# Altium schematic sheet PSDT RAM v1.0.0.SchDoc: Probe-Scope Digital Test: RAM
size Letter; CompanyName: Probe-Scope; Organization: Probe-Scope; Address1: Probe-Scope: Unified USB; Address2: Oscilloscope Probe; Address3: ©2019 M. Omo, J. Rowley,; Address4: K. Hall, released under the; DocumentNumber: SCH0020; SheetNumber: 3; PageSetup: Record=PageOptions|CenterHorizontal=True|CenterVertical=True|PrintScale=0.96|XCorrection=1.00|YCorrection=1.00|PrintKind=1|BorderSize=5000000|LeftOffset=0|BottomOffset=0|Orientation=2|PaperLength=1000|PaperWidth=1000|Scale=100|PaperSource=7|PrintQuality=-4|MediaType=1|DitherType=10|PaperKind=11x17|PrintScaleMode=1; Assembly: ASP0020; License: CERN OHL v1.2
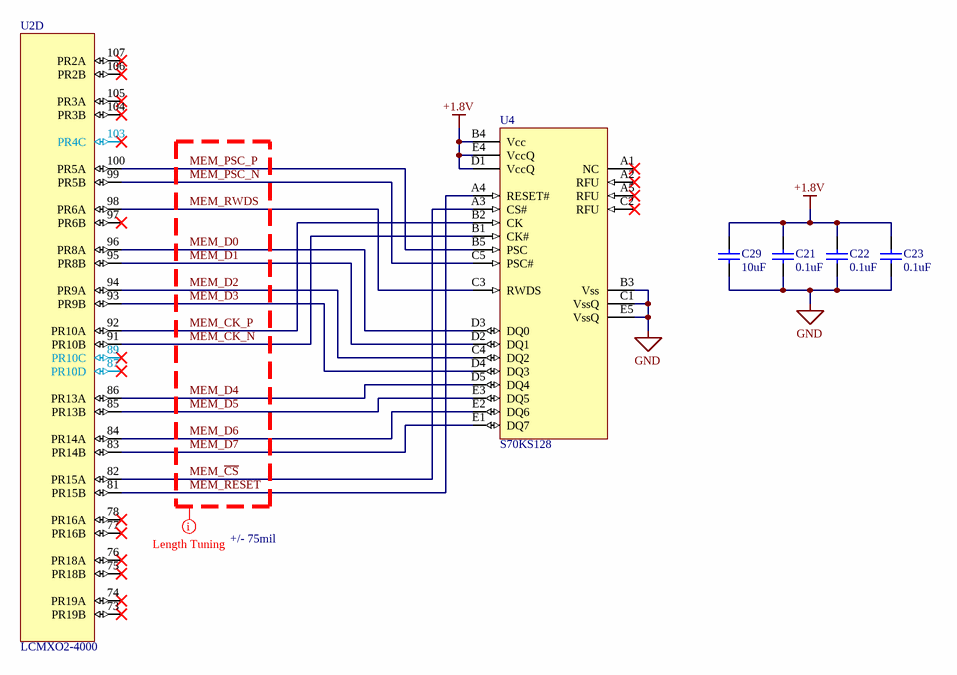
[diagram p0: PSDT RAM v1.0.0.SchDoc]

## Parts
C21  value 0.1uF  [0402(1005)]  (hidden comment: 6.3V)
C22  value 0.1uF  [0402(1005)]  (hidden comment: 6.3V)
C23  value 0.1uF  [0402(1005)]  (hidden comment: 6.3V)
C29  value 10uF  [0603(1608)]  (hidden comment: 25V)
U2  LCMXO2-4000  [UL_TQFP144]  (part D of 5)
U4  S70KS128  [Cypress-VAA024]

## Nets
+1.8V: C21.2 C22.2 C23.2 C29.2 U4.B4(Vcc) U4.D1(VccQ) U4.E4(VccQ)
GND: C21.1 C22.1 C23.1 C29.1 U4.B3(Vss) U4.C1(VssQ) U4.E5(VssQ)
MEM_~{CS}: U2.82(PR15A) U4.A3(CS#)
MEM_CK_N: U2.91(PR10B) U4.B1(CK#)
MEM_CK_P: U2.92(PR10A) U4.B2(CK)
MEM_D0: U2.96(PR8A) U4.D3(DQ0)
MEM_D1: U2.95(PR8B) U4.D2(DQ1)
MEM_D2: U2.94(PR9A) U4.C4(DQ2)
MEM_D3: U2.93(PR9B) U4.D4(DQ3)
MEM_D4: U2.86(PR13A) U4.D5(DQ4)
MEM_D5: U2.85(PR13B) U4.E3(DQ5)
MEM_D6: U2.84(PR14A) U4.E2(DQ6)
MEM_D7: U2.83(PR14B) U4.E1(DQ7)
MEM_PSC_N: U2.99(PR5B) U4.C5(PSC#)
MEM_PSC_P: U2.100(PR5A) U4.B5(PSC)
MEM_~{RESET}: U2.81(PR15B) U4.A4(RESET#)
MEM_RWDS: U2.98(PR6A) U4.C3(RWDS)

Not connected (* = marked no-connect by the designer): U2 73(PR19B)* 74(PR19A)* 75(PR18B)* 76(PR18A)* 77(PR16B)* 78(PR16A)* 87(PR10D)* 89(PR10C)* 97(PR6B)* 103(PR4C)* 104(PR3B)* 105(PR3A)* 106(PR2B)* 107(PR2A)*; U4 A1(NC)* A2(RFU)* A5(RFU)* C2(RFU)*

## Layout directives
net class MEMDDR - 150mil: MEM_CK_N, MEM_CK_P, MEM_D0, MEM_D1, MEM_D2, MEM_D3, MEM_D4, MEM_D5, MEM_D6, MEM_D7, MEM_PSC_N, MEM_PSC_P, MEM_RWDS, MEM_~{CS}, MEM_~{RESET}

## Notes on the sheet
- +/- 75mil
- Title:
- Asm:
- Date:
- Variant:
- Time:
- Number:
- Sheet
- of
- Rev:
- File:

## Library data of the parts
C21-C23 = 1875: Key: 1875; MENG_PN: ???1875; MANF: Samsung Electro-Mechanics; MANF_PN: CL05B104KQ5NNNC; VENDOR: Digikey; VENDOR_PN: 1276-1511-1-ND; P&V Description: Capacitor, Ceramic, 0.1uF, 6.3V, 10% Tol, 125C, X7R, 0402, SMD; Class: Capacitor; Type: Ceramic; Other: X7R; Tolerance: 10; Voltage: 6.3; Max Temperature: 125; Approved: False; Package: 0402; SMD: True; Date Modified: 11/6/2018 11:14:02 AM; Modified By: jrowley; Parent Key: 1875; Verified: False
C29 = 1306: Key: 1306; MENG_PN: ???1306; MANF: Samsung Electro-Mechanics; MANF_PN: CL10A106MA8NRNC; VENDOR: Digikey; VENDOR_PN: 1276-1869-1-ND; P&V Description: Capacitor, Ceramic, 10uF, 25V, 20% Tol, 85C, X5R, 0603, SMD; Class: Capacitor; Type: Ceramic; Other: X5R; Tolerance: 20; Voltage: 25; Max Temperature: 85; Approved: True; Package: 0603; SMD: True; Date Modified: 3/3/2015 11:08:29 AM; Modified By: sotterbacher; Parent Key: 1306; Verified: True
U2 = MachXO2-4000-TG144: MANF: Lattice Semiconductor Corporation; MANF_PN: LCMXO2-4000HC-4TG144C; VENDOR: DigiKey; VENDOR_PN: 220-1460-ND
U4 = S70KS: MANF: Cypress; MANF_PN: S70KS1281DPBHV020; VENDOR: DigiKey; VENDOR_PN: 2015-S70KS1281DPBHV020-ND